# Altium project LM-003.PrjPcb
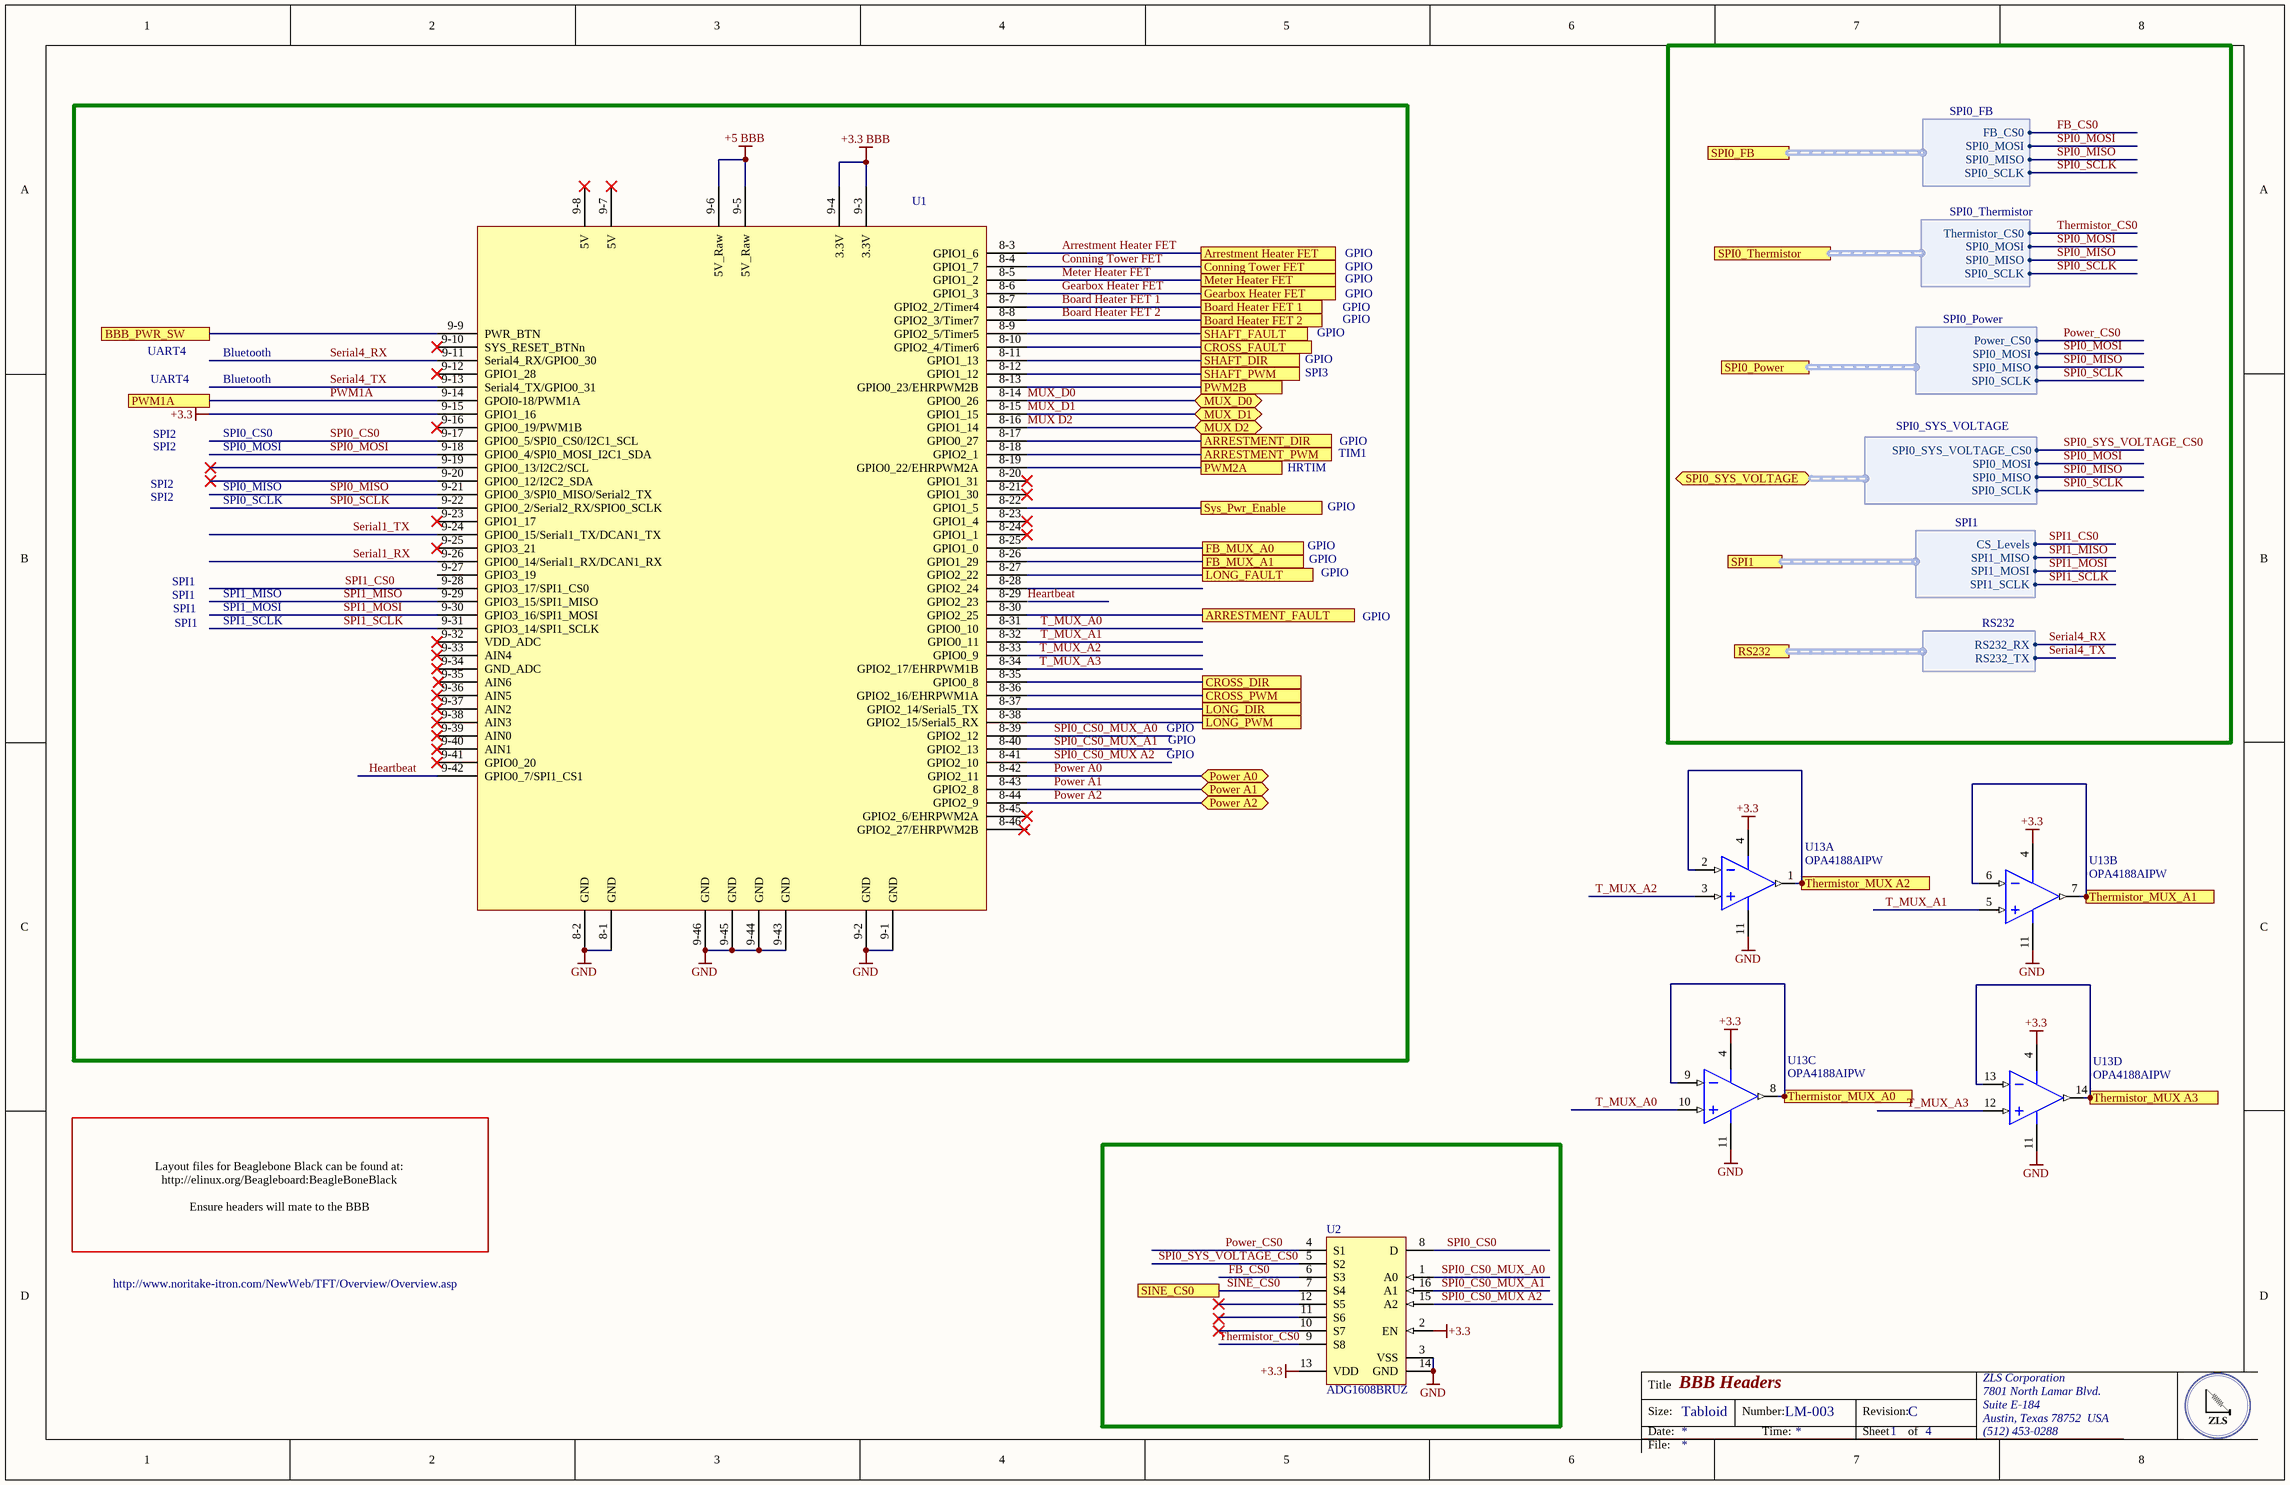
[diagram p0: BBB Headers.SchDoc]
3 sheets, 39 parts. Net scope: flat (ports and power ports of the same name join across sheets).
Board file: LM-003.PcbDoc
Sheets:
  BBB Headers.SchDoc
  Connectors.SchDoc
  heater_control.SchDoc

## Sheet BBB Headers.SchDoc: BBB Headers
size Tabloid; DocumentNumber: LM-003; Revision: C; SheetNumber: 1; SheetTotal: 4

### Parts
U1  BBB Header x 2  [Beaglebone Black Thru]  (value not drawn)
U2  ADG1608BRUZ  [ADI-RU-16_M]
U13  OPA4188AIPW  [PW0014A_N]  (parts A,B,C,D of 4)

### Ports
Arrestment Heater FET, ARRESTMENT_DIR, ARRESTMENT_FAULT, ARRESTMENT_PWM, BBB_PWR_SW, Board Heater FET 1, Board Heater FET 2, Conning Tower FET, CROSS_DIR, CROSS_FAULT, CROSS_PWM, FB_MUX_A0, FB_MUX_A1, Gearbox Heater FET, LONG_DIR, LONG_FAULT, LONG_PWM, Meter Heater FET, MUX D2, MUX_D0, MUX_D1, Power A0, Power A1, Power A2, PWM1A, PWM2A, PWM2B, RS232 (harness RS232), SHAFT_DIR, SHAFT_FAULT, SHAFT_PWM, SINE_CS0, SPI0_FB (harness SPI0_FB), SPI0_Power (harness SPI0_Power), SPI0_SYS_VOLTAGE (harness SPI0_SYS_VOLTAGE), SPI0_Thermistor (harness SPI0_Thermistor), SPI1 (harness SPI1), Sys_Pwr_Enable, Thermistor_MUX A2, Thermistor_MUX A3, Thermistor_MUX_A0, Thermistor_MUX_A1

### Harnesses
RS232: RS232_RX, RS232_TX
SPI1: CS_Levels, SPI1_MISO, SPI1_MOSI, SPI1_SCLK
SPI0_Power: Power_CS0, SPI0_MOSI, SPI0_MISO, SPI0_SCLK
SPI0_Thermistor: Thermistor_CS0, SPI0_MOSI, SPI0_MISO, SPI0_SCLK
SPI0_FB: FB_CS0, SPI0_MOSI, SPI0_MISO, SPI0_SCLK
SPI0_SYS_VOLTAGE: SPI0_SYS_VOLTAGE_CS0, SPI0_MOSI, SPI0_MISO, SPI0_SCLK

### Nets
+3.3: U1.9-15(GPIO1_16) U2.2(EN) U2.13(VDD) U13.4(V+)
+3.3 BBB: U1.9-3(3.3V) U1.9-4(3.3V)
+5 BBB: U1.9-5(5V_Raw) U1.9-6(5V_Raw)
GND: U1.8-1(GND) U1.8-2(GND) U1.9-1(GND) U1.9-2(GND) U1.9-43(GND) U1.9-44(GND) U1.9-45(GND) U1.9-46(GND) U2.3(VSS) U2.14(GND) U13.11(V-)
Arrestment Heater FET: U1.8-3(GPIO1_6) ; port Arrestment Heater FET
BBB_PWR_SW: U1.9-9(PWR_BTN) ; port BBB_PWR_SW
Board Heater FET 1: U1.8-7(GPIO2_2/Timer4) ; port Board Heater FET 1
Board Heater FET 2: U1.8-8(GPIO2_3/Timer7) ; port Board Heater FET 2
Conning Tower FET: U1.8-4(GPIO1_7) ; port Conning Tower FET
FB_CS0: U2.6(S3) ; port SPI0_FB.FB_CS0
FB_MUX_A0: U1.8-25(GPIO1_0) ; port FB_MUX_A0
FB_MUX_A1: U1.8-26(GPIO1_29) ; port FB_MUX_A1
Gearbox Heater FET: U1.8-6(GPIO1_3) ; port Gearbox Heater FET
Heartbeat: U1.8-29(GPIO2_23) U1.9-42(GPIO0_7/SPI1_CS1)
Meter Heater FET: U1.8-5(GPIO1_2) ; port Meter Heater FET
MUX A2: U13.1(OUT_A) U13.2(IN_A-) ; port Thermistor_MUX A2
MUX A3: U13.13(IN_D-) U13.14(OUT_D) ; port Thermistor_MUX A3
MUX D2: U1.8-16(GPIO1_14) ; port MUX D2
MUX_A0: U13.8(OUT_C) U13.9(IN_C-) ; port Thermistor_MUX_A0
MUX_A1: U13.6(IN_B-) U13.7(OUT_B) ; port Thermistor_MUX_A1
MUX_D0: U1.8-14(GPIO0_26) ; port MUX_D0
MUX_D1: U1.8-15(GPIO1_15) ; port MUX_D1
Power A0: U1.8-42(GPIO2_11) ; port Power A0
Power A1: U1.8-43(GPIO2_8) ; port Power A1
Power A2: U1.8-44(GPIO2_9) ; port Power A2
Power_CS0: U2.4(S1) ; port SPI0_Power.Power_CS0
PWM1A: U1.9-14(GPOI0-18/PWM1A) ; port PWM1A
PWM2A: U1.8-19(GPIO0_22/EHRPWM2A) ; port PWM2A
PWM2B: U1.8-13(GPIO0_23/EHRPWM2B) ; port PWM2B
Serial1_RX: U1.9-26(GPIO0_14/Serial1_RX/DCAN1_RX)
Serial1_TX: U1.9-24(GPIO0_15/Serial1_TX/DCAN1_TX)
Serial4_RX: U1.9-11(Serial4_RX/GPIO0_30) ; port RS232.RS232_RX
Serial4_TX: U1.9-13(Serial4_TX/GPIO0_31) ; port RS232.RS232_TX
SINE_CS0: U2.7(S4) ; port SINE_CS0
SPI0_CS0: U1.9-17(GPIO0_5/SPI0_CS0/I2C1_SCL) U2.8(D)
SPI0_CS0_MUX A2: U1.8-41(GPIO2_10) U2.15(A2)
SPI0_CS0_MUX_A0: U1.8-39(GPIO2_12) U2.1(A0)
SPI0_CS0_MUX_A1: U1.8-40(GPIO2_13) U2.16(A1)
SPI0_MISO: U1.9-21(GPIO0_3/SPI0_MISO/Serial2_TX) ; port SPI0_Power.SPI0_MISO, port SPI0_Thermistor.SPI0_MISO, port SPI0_FB.SPI0_MISO, port SPI0_SYS_VOLTAGE.SPI0_MISO
SPI0_MOSI: U1.9-18(GPIO0_4/SPI0_MOSI_I2C1_SDA) ; port SPI0_Power.SPI0_MOSI, port SPI0_Thermistor.SPI0_MOSI, port SPI0_FB.SPI0_MOSI, port SPI0_SYS_VOLTAGE.SPI0_MOSI
SPI0_SCLK: U1.9-22(GPIO0_2/Serial2_RX/SPIO0_SCLK) ; port SPI0_Power.SPI0_SCLK, port SPI0_Thermistor.SPI0_SCLK, port SPI0_FB.SPI0_SCLK, port SPI0_SYS_VOLTAGE.SPI0_SCLK
SPI0_SYS_VOLTAGE_CS0: U2.5(S2) ; port SPI0_SYS_VOLTAGE.SPI0_SYS_VOLTAGE_CS0
SPI1_CS0: U1.9-28(GPIO3_17/SPI1_CS0) ; port SPI1.CS_Levels
SPI1_MISO: U1.9-29(GPIO3_15/SPI1_MISO) ; port SPI1.SPI1_MISO
SPI1_MOSI: U1.9-30(GPIO3_16/SPI1_MOSI) ; port SPI1.SPI1_MOSI
SPI1_SCLK: U1.9-31(GPIO3_14/SPI1_SCLK) ; port SPI1.SPI1_SCLK
Sys_Pwr_Enable: U1.8-22(GPIO1_5) ; port Sys_Pwr_Enable
T_MUX_A0: U1.8-31(GPIO0_10) U13.10(IN_C+)
T_MUX_A1: U1.8-32(GPIO0_11) U13.5(IN_B+)
T_MUX_A2: U1.8-33(GPIO0_9) U13.3(IN_A+)
T_MUX_A3: U1.8-34(GPIO2_17/EHRPWM1B) U13.12(IN_D+)
Thermistor_CS0: U2.9(S8) ; port SPI0_Thermistor.Thermistor_CS0
NetU1_8-9: U1.8-9(GPIO2_5/Timer5) ; port SHAFT_FAULT
NetU1_8-10: U1.8-10(GPIO2_4/Timer6) ; port CROSS_FAULT
NetU1_8-11: U1.8-11(GPIO1_13) ; port SHAFT_DIR
NetU1_8-12: U1.8-12(GPIO1_12) ; port SHAFT_PWM
NetU1_8-17: U1.8-17(GPIO0_27) ; port ARRESTMENT_DIR
NetU1_8-18: U1.8-18(GPIO2_1) ; port ARRESTMENT_PWM
NetU1_8-27: U1.8-27(GPIO2_22) ; port LONG_FAULT
NetU1_8-30: U1.8-30(GPIO2_25) ; port ARRESTMENT_FAULT
NetU1_8-35: U1.8-35(GPIO0_8) ; port CROSS_DIR
NetU1_8-36: U1.8-36(GPIO2_16/EHRPWM1A) ; port CROSS_PWM
NetU1_8-37: U1.8-37(GPIO2_14/Serial5_TX) ; port LONG_DIR
NetU1_8-38: U1.8-38(GPIO2_15/Serial5_RX) ; port LONG_PWM

Not connected (* = marked no-connect by the designer): U1 8-20(GPIO1_31)* 8-21(GPIO1_30)* 8-23(GPIO1_4)* 8-24(GPIO1_1)* 8-28(GPIO2_24) 8-45(GPIO2_6/EHRPWM2A)* 8-46(GPIO2_27/EHRPWM2B) 9-7(5V)* 9-8(5V)* 9-10(SYS_RESET_BTNn)* 9-12(GPIO1_28)* 9-16(GPIO0_19/PWM1B)* 9-19(GPIO0_13/I2C2/SCL)* 9-20(GPIO0_12/I2C2_SDA)* 9-23(GPIO1_17)* 9-25(GPIO3_21)* 9-27(GPIO3_19) 9-32(VDD_ADC)* 9-33(AIN4)* 9-34(GND_ADC)* 9-35(AIN6) 9-36(AIN5)* 9-37(AIN2)* 9-38(AIN3)* 9-39(AIN0)* 9-40(AIN1)* 9-41(GPIO0_20)*; U2 10(S7)* 11(S6) 12(S5)*

### Notes on the sheet
- GPIO
- UART4
- Bluetooth
- SPI0_CS0
- SPI3
- SPI2
- SPI0_MISO
- SPI0_MOSI
- HRTIM
- TIM1
- SPI0_SCLK
- SPI1
- SPI1_MISO
- SPI1_SCLK
- SPI1_MOSI
- Layout files for Beaglebone Black can be found at:
  http://elinux.org/Beagleboard:BeagleBoneBlack
  Ensure headers will mate to the BBB
- http://www.noritake-itron.com/NewWeb/TFT/Overview/Overview.asp
- Title
- Size:
- Date:
- Tabloid
- Number:
- Time:
- Revision:
- Sheet
- of
- ZLS Corporation
- 7801 North Lamar Blvd.
- Suite E-184
- Austin, Texas 78752  USA
- (512) 453-0288
- File:

### Library data of the parts
U1 = Beaglebone_Black: Beaglebone Black Header; Manufacturer: Samtec Inc.; Manufacturer Part Number: SSW-123-03-G-D; Connector Type: Receptacle; Style: Board to Board or Cable; Number of Positions: 46; Number of Positions Loaded: All; Pitch - Mating: 0.100" (2.54mm); Contact Length - Post: 0.394" (10.00mm); Material Flammability Rating: UL94 V-0; Current Rating: 5.7A per Contact; Supplier 1: Digi-Key; Supplier Part Number 1: SSW-123-03-G-D-ND; RoHS: RoHS Compliant; Category: Connectors, Interconnects; Stock 1: 0; Pricing 1: 1=6.51 (USD); Packaging: Bulk; Part Status: Active; Contact Type: Forked; Row Spacing - Mating: 0.100" (2.54mm); Mounting Type: Through Hole; Termination: Solder; Fastening Type: Push-Pull; Contact Finish - Mating: Gold; Contact Finish Thickness - Mating: 20.0µin (0.51µm); Insulation Color: Black; Insulation Height: 0.335" (8.51mm); Operating Temperature: -55°C ~ 125°C; Contact Finish - Post: Gold; Mated Stacking Heights: -; Ingress Protection: -; Features: -; Voltage Rating: -; Applications: -; Insulation Material: Liquid Crystal Polymer (LCP); Contact Shape: Square; Contact Material: Phosphor Bronze; Contact Finish Thickness - Post: 3.00µin (0.076µm)
U2 = CMP-0793-00136-1: 4.5 Ohm Ron, 8-Channel +/-5 V,+12 V, +5 V and +3.3 V Multiplexer, 16-pin SOP (RU-16), Tube; Manufacturer: Analog Devices Inc.; Multiplexer/Demultiplexer Circuit: 8:1; On-State Resistance (Max): 4.5 Ohm; Channel-to-Channel Matching (&Delta;Ron): 120 mOhm; Voltage - Supply, Single (V+): 3.3 V ~ 16 V; Voltage - Supply, Dual (V±): ±3.3 V ~ 8 V; Switch Time (Ton, Toff) (Max): 94ns, 93ns; -3db Bandwidth: 40MHz; Charge Injection: 29pC; Channel Capacitance (CS(off), CD(off)): 19pF, 117pF; Current - Leakage (IS(off)) (Max): 100pA; Crosstalk: -64dB @ 1MHz; Supplier 1: Digi-Key; Supplier Part Number 1: ADG1608BRUZ-ND; Manufacturer Part Number: ADG1608BRUZ; RoHS: RoHS Compliant; Category: Integrated Circuits (ICs); Stock 1: 1151; Pricing 1: 1=9.31, 96=8.01552, 192=6.95979, 576=6.0605 (USD); Packaging: Tube; Part Status: Active; Switch Circuit: -; Operating Temperature: -40°C ~ 125°C (TA); Package / Case: 16-TSSOP (0.173", 4.40mm Width); Supplier Device Package: 16-TSSOP; Base Part Number: ADG1608; ComponentLink1URL: http://www.analog.com/media/en/technical-documentation/data-sheets/ADG1608_1609.pdf; ComponentLink1Description: http://www.analog.com/media/en/technical-documentation/data-sheets/ADG1608_1609.pdf
U13 = CMP-0809-00010-2: 0.03 uV/C, Low Noise, Rail-to-Rail Output, Zero-Drift Operational Amplifier, 4 to 36 V, -40 to 125 degC, 14-pin SOP (PW14), Green (RoHS & no Sb/Br); Manufacturer: Texas Instruments; Number of Channels: 4; SubFamily: High Supply Voltage Amplifier (>=30V), Low Noise Amp (<=10nV/rtHz), Low Offset Voltage Amplifier (<=500uV), Low Power Amp (<=500uA), Zero Drift Precision Amplifier; CMRR(Min)(dB): 120; Iq per channel(Max)(mA): 0.475; Offset Drift(Typ)(uV/C): 0.03; Rating: Catalog; GBW(Typ)(MHz): 2; Total Supply Voltage(Max)(+5V is 5, +/-5V is 10): 36; Slew Rate(Typ)(V/us): 0.8; PackageReference: PW0014A; Eco-Plan: Green (RoHS & no Sb/Br); PackageVersion: 4040064-3/G, 02/2011; PartNumber: OPA4188AIPW; Code_JEDEC: MO-153; ComponentLink3URL: http://www.ti.com/litv/pdf/mpds360; ComponentLink1Description: Manufacturer URL; ComponentLink2Description: Datasheet; PackageDescription: 14-Pin Plastic Small Outline, Body 5 x 4.4 mm, Pitch 0.65 mm; Total Supply Voltage(Min)(+5V is 5, +/-5V is 10): 4; ComponentLink1URL: http://www.ti.com/; ComponentLink3Description: Package Specification; DatasheetVersion: SBOS641B; Mounting Technology: Surface Mount; ComponentLink2URL: http://www.ti.com/lit/ds/symlink/opa4188.pdf; PartId: 1

## Sheet Connectors.SchDoc: Connectors
size OrCAD A; DocumentNumber: LM-003; Revision: C; SheetNumber: 2; SheetTotal: 4
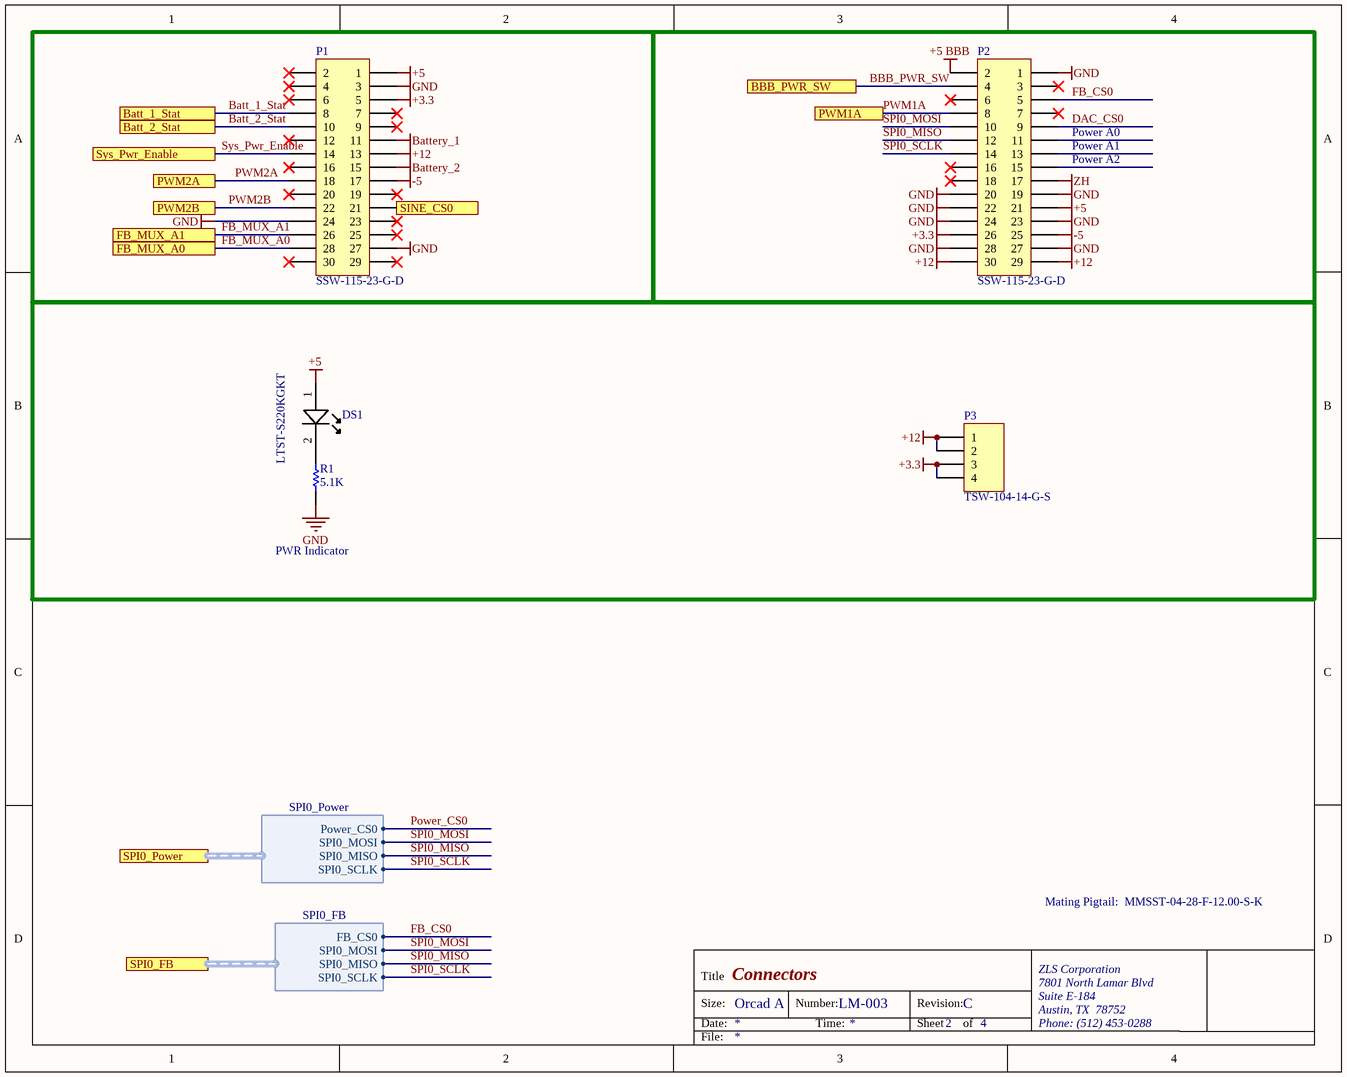
[diagram p1: Connectors.SchDoc]

### Parts
DS1  Manufacturer Part Number: LTST-S220KGKT  [0805C_L]  (hidden comment: Lite-On LTST-S220KGKT Green LED, 571 nm 2012 (0805) Side View, Rectangle Lens SMD package)
P1  SSW-115-23-G-D  [SSW-115-23-G-D]
P2  SSW-115-23-G-D  [SSW-115-23-G-D]
P3  TSW-104-14-G-S  [HDR1X4]
R1  5.1K  [RESC0805(2012)_L]

### Blocks framed on the sheet
PWR Indicator: DS1 P3 R1

### Ports
Batt_1_Stat, Batt_2_Stat, BBB_PWR_SW, FB_MUX_A0, FB_MUX_A1, PWM1A, PWM2A, PWM2B, SINE_CS0, SPI0_FB (harness SPI0_FB), SPI0_Power (harness SPI0_Power), Sys_Pwr_Enable

### Harnesses
SPI0_FB: FB_CS0, SPI0_MOSI, SPI0_MISO, SPI0_SCLK
SPI0_Power: Power_CS0, SPI0_MOSI, SPI0_MISO, SPI0_SCLK

### Nets
+3.3: P1.5 P2.26 P3.3 P3.4
+5: DS1.1(A) P1.1 P2.21
+5 BBB: P2.2
+12: P1.13 P2.29 P2.30 P3.1 P3.2
-5: P1.17 P2.25
Battery_1: P1.11
Battery_2: P1.15
GND: P1.3 P1.24 P1.27 P2.1 P2.19 P2.20 P2.22 P2.23 P2.24 P2.27 P2.28 R1.2
ZH: P2.17
Batt_1_Stat: P1.8 ; port Batt_1_Stat
Batt_2_Stat: P1.10 ; port Batt_2_Stat
BBB_PWR_SW: P2.4 ; port BBB_PWR_SW
DAC_CS0: P2.9
FB_CS0: P2.5 ; port SPI0_FB.FB_CS0
FB_MUX_A0: P1.28 ; port FB_MUX_A0
FB_MUX_A1: P1.26 ; port FB_MUX_A1
PWM1A: P2.8 ; port PWM1A
PWM2A: P1.18 ; port PWM2A
PWM2B: P1.22 ; port PWM2B
SINE_CS0: P1.21 ; port SINE_CS0
SPI0_MISO: P2.12 ; port SPI0_FB.SPI0_MISO, port SPI0_Power.SPI0_MISO
SPI0_MOSI: P2.10 ; port SPI0_FB.SPI0_MOSI, port SPI0_Power.SPI0_MOSI
SPI0_SCLK: P2.14 ; port SPI0_FB.SPI0_SCLK, port SPI0_Power.SPI0_SCLK
Sys_Pwr_Enable: P1.14 ; port Sys_Pwr_Enable
NetDS1_2: DS1.2(K) R1.1

Not connected (* = marked no-connect by the designer): P1 2* 4* 6* 7* 9* 12* 16* 19* 20* 23* 25* 29* 30*; P2 3* 6* 7* 11 13 15 16* 18*

### Notes on the sheet
- (near P2) Power A0
- (near P2) Power A1
- (near P2) Power A2
- Mating Pigtail:  MMSST-04-28-F-12.00-S-K
- Title
- Size:
- Date:
- Orcad A
- Number:
- Time:
- Revision:
- Sheet
- of
- ZLS Corporation
- 7801 North Lamar Blvd
- Suite E-184
- Austin, TX  78752
- Phone: (512) 453-0288
- File:

### Library data of the parts
DS1 = LED A/K: Manufacturer: Vishay / Lite-On; Lens Colour: Colorless; Viewing Angle: 130°; Luminous Intensity: 35mcd; Forward Current: 20mA; Forward Voltage: 2V; Lens Style: Diffused,Colorless; Power Rating: 75mW; Dominant Wavelength: 568nm; Lens Transparency: Clear; Number of Elements: 1; Power Dissipation: 75W; Wavelength: 574nm; Supplier 1: Digi-Key; Supplier Part Number 1: 160-1468-1-ND; Stock 1: 74800; Pricing 1: 1=0.29, 10=0.212, 25=0.1564, 100=0.1117, 250=0.0759, 500=0.067, 1000=0.0525 (USD); Mount: Surface Mount; Case/Package: 0805; Number of Pins: 2; Colour: Green; Case Code (Metric): 2012; Case Code (Imperial): 0805; Min Operating Temperature: -55°C; Max Operating Temperature: 85°C; Packaging: Tape and Reel; Package Quantity: 4000; Illumination Colour: Green; Test Current: 20mA; Number of LEDs: 1; Length: 2.1mm; Height: 0.6mm; Width: 1mm; Depth: 0.6mm; Radiation Hardening: No; Lead Free: Lead Free; ComponentLink1URL: https://datasheet.ciiva.com/11775/0900766b80dc0b70-11775441.pdf; ComponentLink1Description: https://datasheet.ciiva.com/11775/0900766b80dc0b70-11775441.pdf; ComponentLink2URL: https://datasheet.ciiva.com/2110/s-110-ltst-s220kgkt-2110069.pdf; ComponentLink2Description: https://datasheet.ciiva.com/2110/s-110-ltst-s220kgkt-2110069.pdf; ComponentLink3URL: https://datasheet.ciiva.com/2110/s-110-ltst-s220kgkt-2110070.pdf; ComponentLink3Description: https://datasheet.ciiva.com/2110/s-110-ltst-s220kgkt-2110070.pdf; ComponentLink4URL: https://datasheet.ciiva.com/12400/100-ltst-s220kgkt-59602-12400886.pdf; ComponentLink4Description: https://datasheet.ciiva.com/12400/100-ltst-s220kgkt-59602-12400886.pdf; ComponentLink5URL: https://datasheet.ciiva.com/2110/s-110-ltst-s220kgkt-2110071.pdf; ComponentLink5Description: https://datasheet.ciiva.com/2110/s-110-ltst-s220kgkt-2110071.pdf; ComponentLink6URL: https://datasheet.ciiva.com/16379/ltst-s220kgkt-16379082.pdf; ComponentLink6Description: https://datasheet.ciiva.com/16379/ltst-s220kgkt-16379082.pdf
P1 P2 = Header 15X2: Header, 15-Pin, Dual row; Manufacturer: Samtec Inc.; Connector Type: Receptacle; Style: Board to Board or Cable; Number of Positions: 30; Number of Positions Loaded: All; Pitch - Mating: 0.100" (2.54mm); Contact Length - Post: 0.394" (10.00mm); Material Flammability Rating: UL94 V-0; Current Rating: 5.7A per Contact; Supplier 1: Digi-Key; Supplier Part Number 1: SSW-115-23-G-D-ND; Manufacturer Part Number: SSW-115-23-G-D; RoHS: RoHS Compliant; Category: Connectors, Interconnects; Stock 1: 0; Pricing 1: 1=5.3 (USD); Packaging: Bulk; Part Status: Active; Contact Type: Forked; Row Spacing - Mating: 0.100" (2.54mm); Mounting Type: Through Hole; Termination: Solder; Fastening Type: Push-Pull; Contact Finish - Mating: Gold; Contact Finish Thickness - Mating: 20.0µin (0.51µm); Insulation Color: Black; Insulation Height: 0.335" (8.51mm); Operating Temperature: -55°C ~ 125°C; Contact Finish - Post: Gold; Mated Stacking Heights: -; Ingress Protection: -; Features: -; Voltage Rating: -; Applications: -; Insulation Material: Liquid Crystal Polymer (LCP); Contact Shape: Square; Contact Material: Phosphor Bronze; Contact Finish Thickness - Post: 3.00µin (0.076µm)
P3 = Header 4: Header, 4-Pin; Manufacturer: Samtec Inc.; Pitch - Mating: 0.100" (2.54mm); Number of Positions: 4; Number of Positions Loaded: All; Style: Board to Board or Cable; Shrouding: Unshrouded; Contact Length - Mating: 0.320" (8.13mm); Contact Length - Post: 0.110" (2.79mm); Overall Contact Length: 0.530" (13.46mm); Material Flammability Rating: UL94 V-0; Supplier 1: Digi-Key; Supplier Part Number 1: SAM1053-04-ND; Manufacturer Part Number: TSW-104-14-G-S; RoHS: RoHS Compliant; Category: Connectors, Interconnects; Stock 1: 278; Pricing 1: 1=1.02, 10=0.915, 100=0.7537, 500=0.59578, 1000=0.51143, 5000=0.46657, 10000=0.44863 (USD); Packaging: Bulk; Part Status: Active; Connector Type: Header; Contact Type: Male Pin; Number of Rows: 1; Row Spacing - Mating: -; Mounting Type: Through Hole; Termination: Solder; Fastening Type: Push-Pull; Insulation Height: 0.100" (2.54mm); Contact Shape: Square; Contact Finish - Mating: Gold; Contact Finish Thickness - Mating: 10.0µin (0.25µm); Contact Finish - Post: Gold; Contact Material: Phosphor Bronze; Insulation Material: Polybutylene Terephthalate (PBT); Features: -; Operating Temperature: -55°C ~ 125°C; Ingress Protection: -; Insulation Color: Black; Current Rating: -; Voltage Rating: -; Mated Stacking Heights: -; Contact Finish Thickness - Post: 3.00µin (0.076µm); Applications: -; ComponentLink1URL: http://suddendocs.samtec.com/prints/tsw-xxx-xx-xxx-x-xx-xxx-mkt.pdf; ComponentLink1Description: http://suddendocs.samtec.com/prints/tsw-xxx-xx-xxx-x-xx-xxx-mkt.pdf
R1 = CMP-1013-00215-1: RES SMD 5.1K OHM 5% 1/8W 0805; Manufacturer: Vishay Dale; Manufacturer Part Number: CRCW08055K10JNEA; Power (Watts): 0.125W, 1/8W; Temperature Coefficient: ±200ppm/°C; Supplier 1: Digi-Key; Supplier Part Number 1: 541-5.1KACT-ND; RoHS: RoHS Compliant; Category: Resistors; Stock 1: 429; Pricing 1: 1=0.1, 10=0.044, 100=0.0178, 1000=0.00802, 2500=0.00696 (USD); Packaging: Cut Tape (CT); Part Status: Active; Tolerance: ±5%; Composition: Thick Film; Features: Automotive AEC-Q200; Operating Temperature: -55°C ~ 155°C; Package / Case: 0805 (2012 Metric); Supplier Device Package: 0805; Size / Dimension: 0.079" L x 0.049" W (2.00mm x 1.25mm); Height - Seated (Max): 0.020" (0.50mm); Failure Rate: -; ComponentLink1URL: http://www.vishay.com/docs/20035/dcrcwe3.pdf; ComponentLink1Description: http://www.vishay.com/docs/20035/dcrcwe3.pdf

## Sheet heater_control.SchDoc: Heater Control
size Tabloid; DocumentNumber: LM-003; Revision: C; SheetNumber: 3; SheetTotal: 4
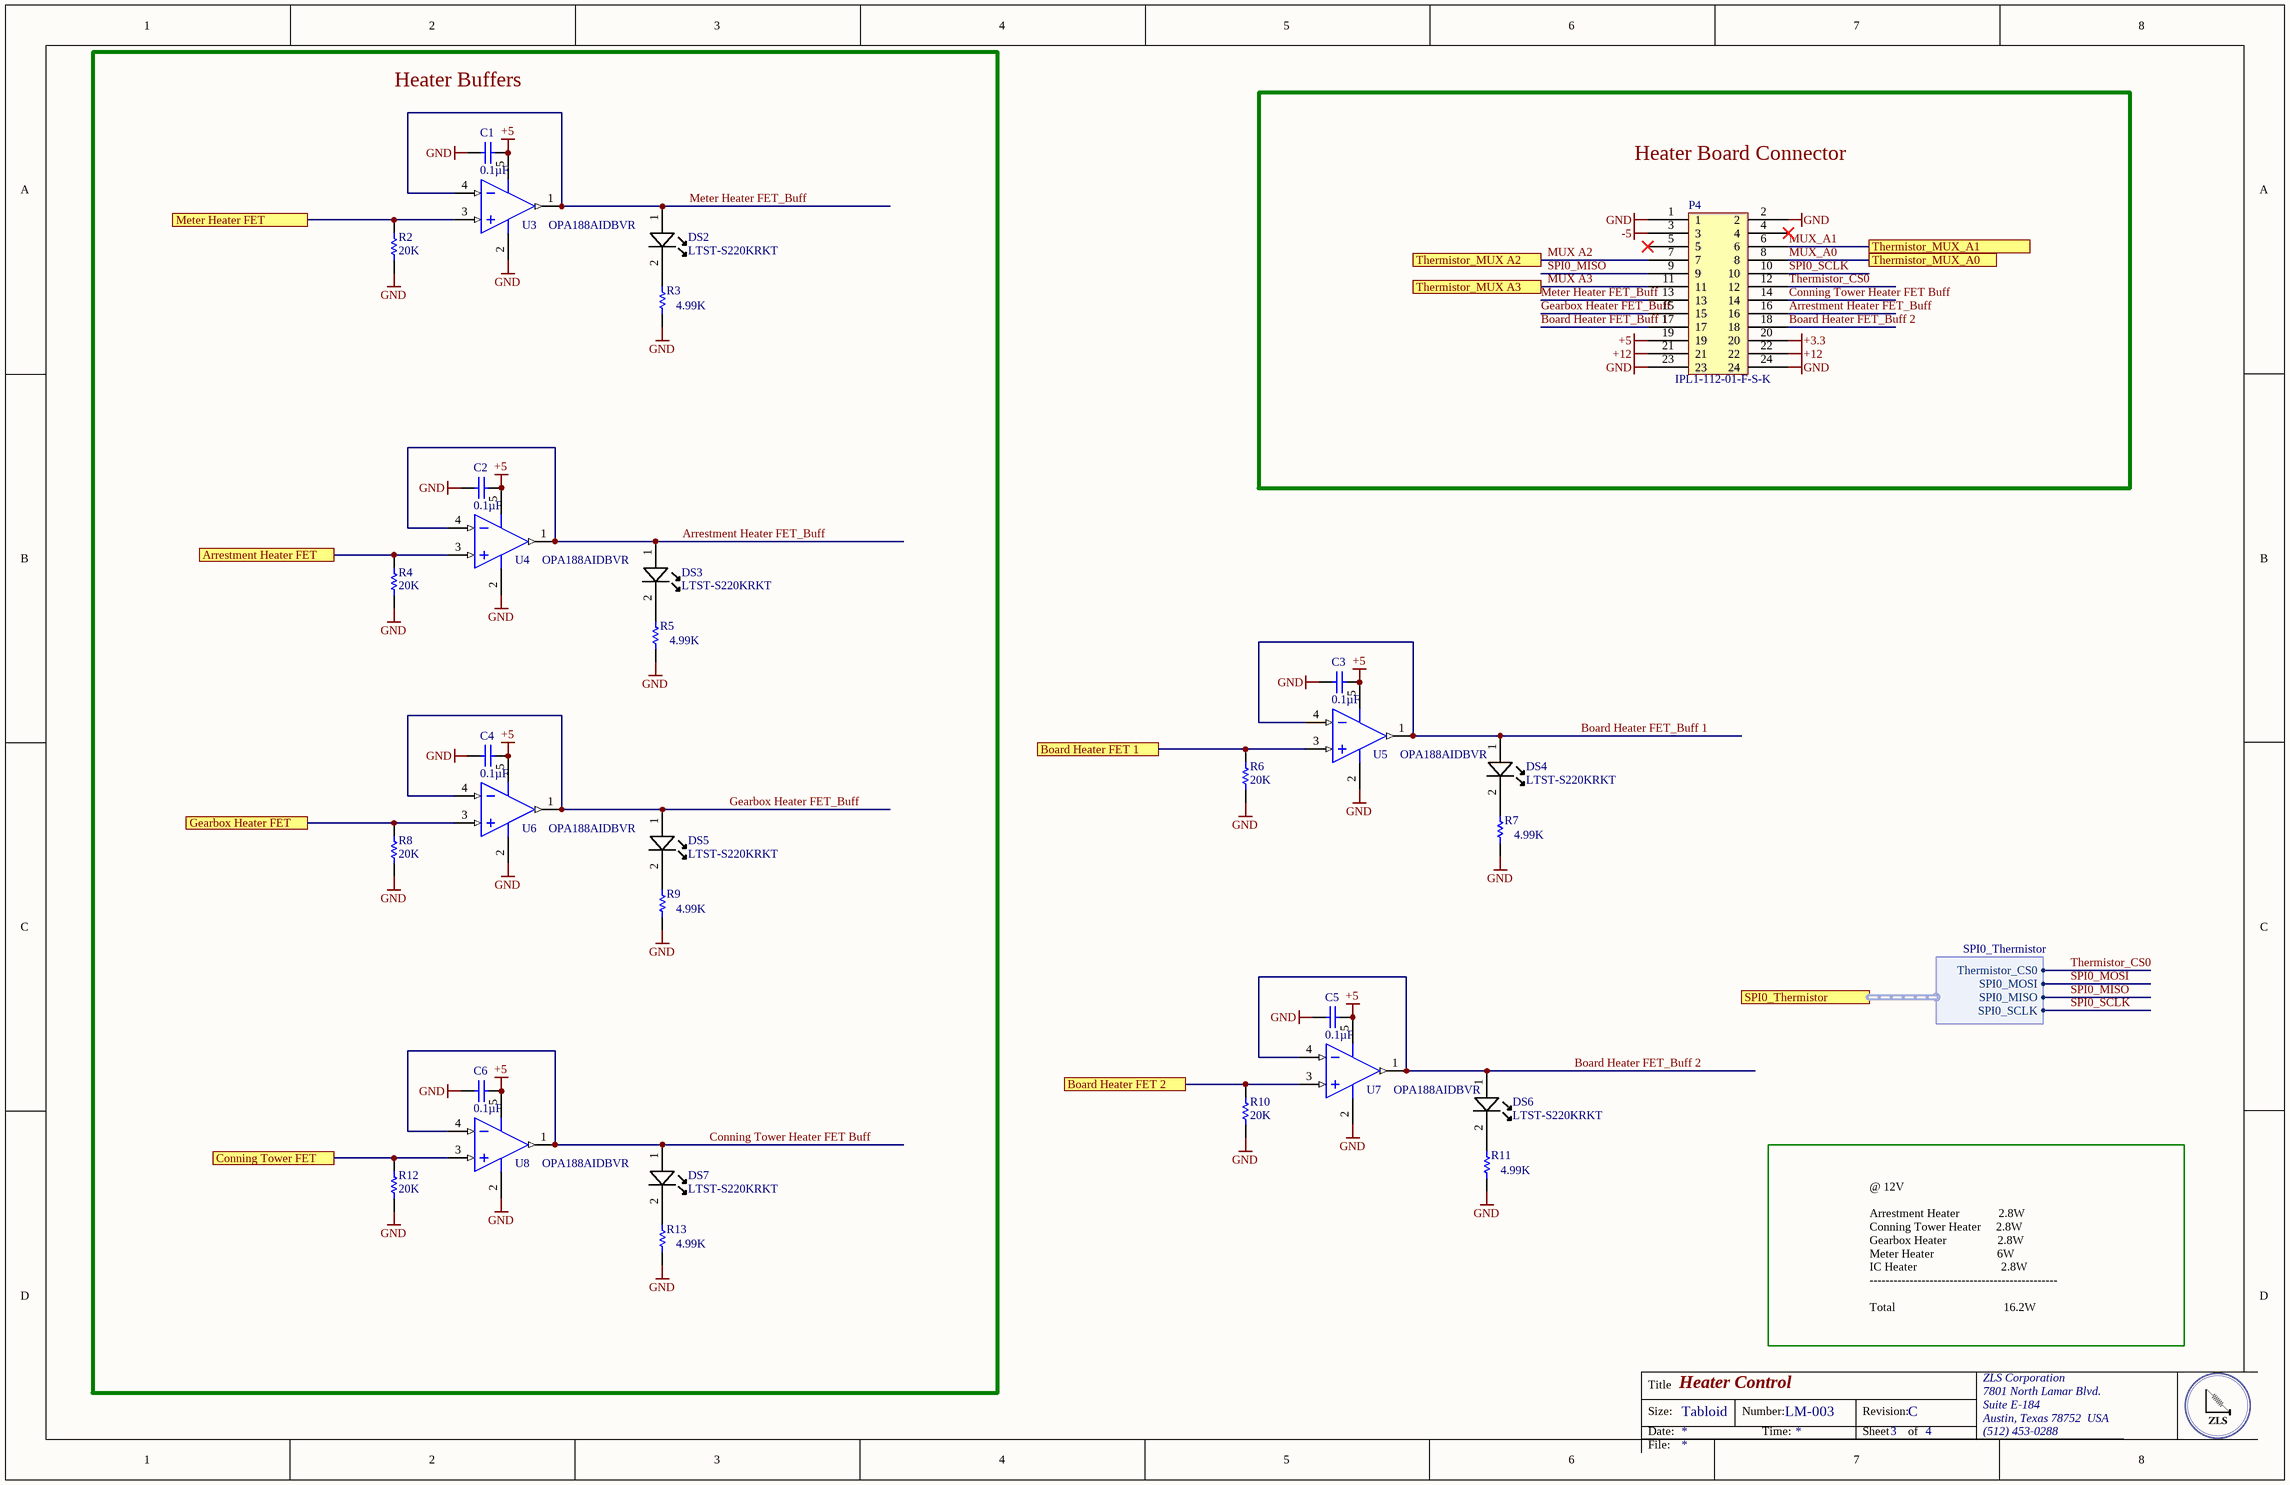
[diagram p2: heater_control.SchDoc]

### Parts
C1  Capacitance: 0.1µF  [CAPC0805(2012)145_N]  (hidden comment: CAP CER 0.1UF 25V X7R 0805)
C2  Capacitance: 0.1µF  [CAPC0805(2012)145_N]  (hidden comment: CAP CER 0.1UF 25V X7R 0805)
C3  Capacitance: 0.1µF  [CAPC0805(2012)145_N]  (hidden comment: CAP CER 0.1UF 25V X7R 0805)
C4  Capacitance: 0.1µF  [CAPC0805(2012)145_N]  (hidden comment: CAP CER 0.1UF 25V X7R 0805)
C5  Capacitance: 0.1µF  [CAPC0805(2012)145_N]  (hidden comment: CAP CER 0.1UF 25V X7R 0805)
C6  Capacitance: 0.1µF  [CAPC0805(2012)145_N]  (hidden comment: CAP CER 0.1UF 25V X7R 0805)
DS2  Manufacturer Part Number: LTST-S220KRKT  [0805C_L]  (hidden comment: Visible Name Value Type    False Description Lite-On LTST-S220KRKT Red LED, 631 nm 2012 (0805) Side View, Rectangle Lens SMD package STRING)
DS3  Manufacturer Part Number: LTST-S220KRKT  [0805C_L]  (hidden comment: Visible Name Value Type    False Description Lite-On LTST-S220KRKT Red LED, 631 nm 2012 (0805) Side View, Rectangle Lens SMD package STRING)
DS4  Manufacturer Part Number: LTST-S220KRKT  [0805C_L]  (hidden comment: Visible Name Value Type    False Description Lite-On LTST-S220KRKT Red LED, 631 nm 2012 (0805) Side View, Rectangle Lens SMD package STRING)
DS5  Manufacturer Part Number: LTST-S220KRKT  [0805C_L]  (hidden comment: Visible Name Value Type    False Description Lite-On LTST-S220KRKT Red LED, 631 nm 2012 (0805) Side View, Rectangle Lens SMD package STRING)
DS6  Manufacturer Part Number: LTST-S220KRKT  [0805C_L]  (hidden comment: Visible Name Value Type    False Description Lite-On LTST-S220KRKT Red LED, 631 nm 2012 (0805) Side View, Rectangle Lens SMD package STRING)
DS7  Manufacturer Part Number: LTST-S220KRKT  [0805C_L]  (hidden comment: Visible Name Value Type    False Description Lite-On LTST-S220KRKT Red LED, 631 nm 2012 (0805) Side View, Rectangle Lens SMD package STRING)
P4  IPL1-112-01-F-S-K  [IPL1-112-01-F-S-K]
R2  20K  [RESC0805(2012)_L]
R3  4.99K  [RESC0805(2012)_L]
R4  20K  [RESC0805(2012)_L]
R5  4.99K  [RESC0805(2012)_L]
R6  20K  [RESC0805(2012)_L]
R7  4.99K  [RESC0805(2012)_L]
R8  20K  [RESC0805(2012)_L]
R9  4.99K  [RESC0805(2012)_L]
R10  20K  [RESC0805(2012)_L]
R11  4.99K  [RESC0805(2012)_L]
R12  20K  [RESC0805(2012)_L]
R13  4.99K  [RESC0805(2012)_L]
U3  OPA188AIDBVR  [DBV0005A_M]
U4  OPA188AIDBVR  [DBV0005A_M]
U5  OPA188AIDBVR  [DBV0005A_M]
U6  OPA188AIDBVR  [DBV0005A_M]
U7  OPA188AIDBVR  [DBV0005A_M]
U8  OPA188AIDBVR  [DBV0005A_M]

### Blocks framed on the sheet
Heater Buffers: C1 C2 C4 C6 DS2 DS3 DS5 DS7 R2-R5 R8 R9 R12 R13 U3 U4 U6 U8
Heater Board Connector: P4

### Ports
Arrestment Heater FET, Board Heater FET 1, Board Heater FET 2, Conning Tower FET, Gearbox Heater FET, Meter Heater FET, SPI0_Thermistor (harness SPI0_Thermistor), Thermistor_MUX A2, Thermistor_MUX A3, Thermistor_MUX_A0, Thermistor_MUX_A1

### Harnesses
SPI0_Thermistor: Thermistor_CS0, SPI0_MOSI, SPI0_MISO, SPI0_SCLK

### Nets
+3.3: P4.20
+5: C1.2 C2.2 C3.2 C4.2 C5.2 C6.2 P4.19 U3.5(V+) U4.5(V+) U5.5(V+) U6.5(V+) U7.5(V+) U8.5(V+)
+12: P4.21 P4.22
-5: P4.3
GND: C1.1 C2.1 C3.1 C4.1 C5.1 C6.1 P4.1 P4.2 P4.23 P4.24 R2.2 R3.2 R4.2 R5.2 R6.2 R7.2 R8.2 R9.2 R10.2 R11.2 R12.2 R13.2 U3.2(V-) U4.2(V-) U5.2(V-) U6.2(V-) U7.2(V-) U8.2(V-)
Arrestment Heater FET: R4.1 U4.3(IN+) ; port Arrestment Heater FET
Arrestment Heater FET_Buff: DS3.1(A) P4.16 U4.1(OUT) U4.4(IN-)
Board Heater FET 1: R6.1 U5.3(IN+) ; port Board Heater FET 1
Board Heater FET 2: R10.1 U7.3(IN+) ; port Board Heater FET 2
Board Heater FET_Buff 1: DS4.1(A) P4.17 U5.1(OUT) U5.4(IN-)
Board Heater FET_Buff 2: DS6.1(A) P4.18 U7.1(OUT) U7.4(IN-)
Conning Tower FET: R12.1 U8.3(IN+) ; port Conning Tower FET
Conning Tower Heater FET Buff: DS7.1(A) P4.14 U8.1(OUT) U8.4(IN-)
Gearbox Heater FET: R8.1 U6.3(IN+) ; port Gearbox Heater FET
Gearbox Heater FET_Buff: DS5.1(A) P4.15 U6.1(OUT) U6.4(IN-)
Meter Heater FET: R2.1 U3.3(IN+) ; port Meter Heater FET
Meter Heater FET_Buff: DS2.1(A) P4.13 U3.1(OUT) U3.4(IN-)
MUX A2: P4.7 ; port Thermistor_MUX A2
MUX A3: P4.11 ; port Thermistor_MUX A3
MUX_A0: P4.8 ; port Thermistor_MUX_A0
MUX_A1: P4.6 ; port Thermistor_MUX_A1
SPI0_MISO: P4.9 ; port SPI0_Thermistor.SPI0_MISO
SPI0_SCLK: P4.10 ; port SPI0_Thermistor.SPI0_SCLK
Thermistor_CS0: P4.12 ; port SPI0_Thermistor.Thermistor_CS0
NetDS2_2: DS2.2(K) R3.1
NetDS3_2: DS3.2(K) R5.1
NetDS4_2: DS4.2(K) R7.1
NetDS5_2: DS5.2(K) R9.1
NetDS6_2: DS6.2(K) R11.1
NetDS7_2: DS7.2(K) R13.1

Not connected (* = marked no-connect by the designer): P4 4* 5*

### Notes on the sheet
- @ 12V
  Arrestment Heater             2.8W
  Conning Tower Heater     2.8W
  Gearbox Heater                 2.8W
  Meter Heater                     6W
  IC Heater                            2.8W
  -----------------------------------------------
  Total                                    16.2W
- Title
- Size:
- Date:
- Tabloid
- Number:
- Time:
- Revision:
- Sheet
- of
- ZLS Corporation
- 7801 North Lamar Blvd.
- Suite E-184
- Austin, Texas 78752  USA
- (512) 453-0288
- File:

### Library data of the parts
C1-C6 = CMP-1036-04795-1: Manufacturer: Murata Electronics North America; Manufacturer Part Number: GRM21BR71E104KA01L; Tolerance: ±10%; Supplier 1: Digi-Key; Supplier Part Number 1: 490-1673-6-ND; RoHS: RoHS Compliant; Category: Capacitors; Stock 1: 891652; Pricing 1: 1=0.2, 10=0.145, 100=0.0683, 500=0.04788, 1000=0.03964 (USD); Packaging: Digi-Reel®; Part Status: Active; Voltage - Rated: 25V; Temperature Coefficient: X7R; Operating Temperature: -55°C ~ 125°C; Features: -; Ratings: -; Applications: General Purpose; Mounting Type: Surface Mount, MLCC; Package / Case: 0805 (2012 Metric); Size / Dimension: 0.079" L x 0.049" W (2.00mm x 1.25mm); Height - Seated (Max): -; Thickness (Max): 0.053" (1.35mm); Lead Spacing: -; Lead Style: -; ComponentLink1URL: http://www.murata.com/~/media/webrenewal/support/library/catalog/products/capacitor/mlcc/c02e.ashx; ComponentLink1Description: http://www.murata.com/~/media/webrenewal/support/library/catalog/products/capacitor/mlcc/c02e.ashx
DS2-DS7 = LED A/K: Manufacturer: Vishay / Lite-On; Lens Colour: Colorless; Lens Style: Diffused,Colorless; Viewing Angle: 130°; Luminous Intensity: 54mcd; Forward Current: 20mA; Forward Voltage: 2V; Power Rating: 75mW; Dominant Wavelength: 631nm; Lens Transparency: Clear; Number of Elements: 1; Wavelength: 639nm; Supplier 1: Digi-Key; Supplier Part Number 1: 160-1469-1-ND; Stock 1: 108191; Pricing 1: 1=0.31, 10=0.225, 25=0.1656, 100=0.1183, 250=0.0804, 500=0.071, 1000=0.0556 (USD); Mount: Surface Mount; Case/Package: 0805; Number of Pins: 2; Colour: Red; Case Code (Metric): 2012; Case Code (Imperial): 0805; Min Operating Temperature: -55°C; Max Operating Temperature: 85°C; Packaging: Tape and Reel; Package Quantity: 4000; Illumination Colour: Red; Test Current: 20mA; Power Dissipation: 75mW; Number of LEDs: 1; Length: 2.1mm; Height: 0.6mm; Width: 1mm; Depth: 0.6mm; Radiation Hardening: No; Lead Free: Lead Free; ComponentLink1URL: https://datasheet.ciiva.com/2110/s-110-ltst-s220krkt-2110132.pdf; ComponentLink1Description: https://datasheet.ciiva.com/2110/s-110-ltst-s220krkt-2110132.pdf; ComponentLink2URL: https://datasheet.ciiva.com/2110/s-110-ltst-s220krkt-2110133.pdf; ComponentLink2Description: https://datasheet.ciiva.com/2110/s-110-ltst-s220krkt-2110133.pdf; ComponentLink3URL: https://datasheet.ciiva.com/2110/s-110-ltst-s220krkt-2110134.pdf; ComponentLink3Description: https://datasheet.ciiva.com/2110/s-110-ltst-s220krkt-2110134.pdf; ComponentLink4URL: https://datasheet.ciiva.com/12403/lite-on-ltst-s220krkt-187389-12403798.pdf; ComponentLink4Description: https://datasheet.ciiva.com/12403/lite-on-ltst-s220krkt-187389-12403798.pdf; ComponentLink5URL: https://datasheet.ciiva.com/16345/lite-onltst-s220krkt-16345511.pdf; ComponentLink5Description: https://datasheet.ciiva.com/16345/lite-onltst-s220krkt-16345511.pdf; ComponentLink6URL: https://datasheet.ciiva.com/15118/getdatasheetpartid-225752-15118120.pdf; ComponentLink6Description: https://datasheet.ciiva.com/15118/getdatasheetpartid-225752-15118120.pdf; ComponentLink7URL: https://datasheet.ciiva.com/14633/0900766b80dc0b76-14633737.pdf; ComponentLink7Description: https://datasheet.ciiva.com/14633/0900766b80dc0b76-14633737.pdf; ComponentLink8URL: https://datasheet.ciiva.com/11775/0900766b80dc0b76-11775439.pdf; ComponentLink8Description: https://datasheet.ciiva.com/11775/0900766b80dc0b76-11775439.pdf
P4 = IPL1-112-01-F-S-K: IPL1-112-01-F-D-K; Manufacturer: Samtec Inc.; Supplier 1: Digi-Key; Supplier Part Number 1: IPL1-112-01-F-S-K-ND; Manufacturer Part Number: IPL1-112-01-F-S-K; RoHS: RoHS Compliant; Category: Connectors, Interconnects; Stock 1: 0; Pricing 1: 1=2.63 (USD); Part Status: Active
R2 R4 R6 R8 R10 R12 = CMP-1013-00215-1: RES SMD 20K OHM 1% 1/8W 0805; Manufacturer: Panasonic Electronic Components; Manufacturer Part Number: ERJ-6ENF2002V; Power (Watts): 0.125W, 1/8W; Temperature Coefficient: ±100ppm/°C; Supplier 1: Digi-Key; Supplier Part Number 1: P20.0KCCT-ND; RoHS: RoHS Compliant; Category: Resistors; Stock 1: 269698; Pricing 1: 1=0.11, 10=0.1, 100=0.0385, 1000=0.01695, 2500=0.01464 (USD); Packaging: Cut Tape (CT); Part Status: Active; Tolerance: ±1%; Composition: Thick Film; Features: Automotive AEC-Q200; Operating Temperature: -55°C ~ 155°C; Package / Case: 0805 (2012 Metric); Supplier Device Package: 0805; Size / Dimension: 0.079" L x 0.049" W (2.00mm x 1.25mm); Height - Seated (Max): 0.028" (0.70mm); Failure Rate: -; ComponentLink1URL: https://industrial.panasonic.com/cdbs/www-data/pdf/RDA0000/AOA0000C304.pdf; ComponentLink1Description: https://industrial.panasonic.com/cdbs/www-data/pdf/RDA0000/AOA0000C304.pdf
R3 R5 R7 R9 R11 R13 = CMP-1013-00215-1: RES SMD 4.99K OHM 1% 1/8W 0805; Manufacturer: Panasonic Electronic Components; Manufacturer Part Number: ERJ-6ENF4991V; Power (Watts): 0.125W, 1/8W; Temperature Coefficient: ±100ppm/°C; Supplier 1: Digi-Key; Supplier Part Number 1: P4.99KCCT-ND; RoHS: RoHS Compliant; Category: Resistors; Stock 1: 1015773; Pricing 1: 1=0.11, 10=0.1, 100=0.0385, 1000=0.01695, 2500=0.01464 (USD); Packaging: Cut Tape (CT); Part Status: Active; Tolerance: ±1%; Composition: Thick Film; Features: Automotive AEC-Q200; Operating Temperature: -55°C ~ 155°C; Package / Case: 0805 (2012 Metric); Supplier Device Package: 0805; Size / Dimension: 0.079" L x 0.049" W (2.00mm x 1.25mm); Height - Seated (Max): 0.028" (0.70mm); Failure Rate: -; ComponentLink1URL: https://industrial.panasonic.com/cdbs/www-data/pdf/RDA0000/AOA0000C304.pdf; ComponentLink1Description: https://industrial.panasonic.com/cdbs/www-data/pdf/RDA0000/AOA0000C304.pdf
U3-U8 = CMP-0809-00005-2: Precision, Low Noise, Rail-to-Rail Output, Zero-Drift Operational Amplifier, 4 to 36 V, -40 to 125 degC, 5-pin SOT23 (DBV5), Green (RoHS & no Sb/Br); Manufacturer: Texas Instruments; Slew Rate: 0.8 V/µs; Current - Supply: 450µA; Voltage - Supply, Single/Dual (±): 4 V ~ 36 V, ±2 V ~ 18 V; Supplier 1: Digi-Key; Supplier Part Number 1: 296-40438-1-ND; Manufacturer Part Number: OPA188AIDBVR; RoHS: RoHS Compliant; Category: Integrated Circuits (ICs); Stock 1: 1779; Pricing 1: 1=2.46, 10=2.211, 100=1.7771, 500=1.46002, 1000=1.20974 (USD); Packaging: Cut Tape (CT); Part Status: Active; Amplifier Type: Zero-Drift; Output Type: Rail-to-Rail; Operating Temperature: -40°C ~ 125°C; Mounting Type: Surface Mount; Package / Case: SC-74A, SOT-753; Supplier Device Package: SOT-23-5; ComponentLink1URL: http://www.ti.com/lit/ds/symlink/opa188.pdf; ComponentLink1Description: http://www.ti.com/lit/ds/symlink/opa188.pdf

## Nets that join several sheets
+3.3: BBB Headers (U1.9-15 U2.2 U2.13 U13.4), Connectors (P1.5 P2.26 P3.3 P3.4), heater_control (P4.20)
+5: Connectors (DS1.1 P1.1 P2.21), heater_control (13 pins)
+5 BBB: BBB Headers (U1.9-5 U1.9-6), Connectors (P2.2)
+12: Connectors (5 pins), heater_control (P4.21 P4.22)
-5: Connectors (P1.17 P2.25), heater_control (P4.3)
GND: BBB Headers (11 pins), Connectors (12 pins), heater_control (28 pins)
Arrestment Heater FET: BBB Headers (U1.8-3), heater_control (R4.1 U4.3)
BBB_PWR_SW: BBB Headers (U1.9-9), Connectors (P2.4)
Board Heater FET 1: BBB Headers (U1.8-7), heater_control (R6.1 U5.3)
Board Heater FET 2: BBB Headers (U1.8-8), heater_control (R10.1 U7.3)
Conning Tower FET: BBB Headers (U1.8-4), heater_control (R12.1 U8.3)
FB_CS0: BBB Headers (U2.6), Connectors (P2.5)
FB_MUX_A0: BBB Headers (U1.8-25), Connectors (P1.28)
FB_MUX_A1: BBB Headers (U1.8-26), Connectors (P1.26)
Gearbox Heater FET: BBB Headers (U1.8-6), heater_control (R8.1 U6.3)
Meter Heater FET: BBB Headers (U1.8-5), heater_control (R2.1 U3.3)
MUX A2: BBB Headers (U13.1 U13.2), heater_control (P4.7)
MUX A3: BBB Headers (U13.13 U13.14), heater_control (P4.11)
MUX_A0: BBB Headers (U13.8 U13.9), heater_control (P4.8)
MUX_A1: BBB Headers (U13.6 U13.7), heater_control (P4.6)
PWM1A: BBB Headers (U1.9-14), Connectors (P2.8)
PWM2A: BBB Headers (U1.8-19), Connectors (P1.18)
PWM2B: BBB Headers (U1.8-13), Connectors (P1.22)
SINE_CS0: BBB Headers (U2.7), Connectors (P1.21)
SPI0_MISO: BBB Headers (U1.9-21), Connectors (P2.12), heater_control (P4.9)
SPI0_MOSI: BBB Headers (U1.9-18), Connectors (P2.10)
SPI0_SCLK: BBB Headers (U1.9-22), Connectors (P2.14), heater_control (P4.10)
Sys_Pwr_Enable: BBB Headers (U1.8-22), Connectors (P1.14)
Thermistor_CS0: BBB Headers (U2.9), heater_control (P4.12)